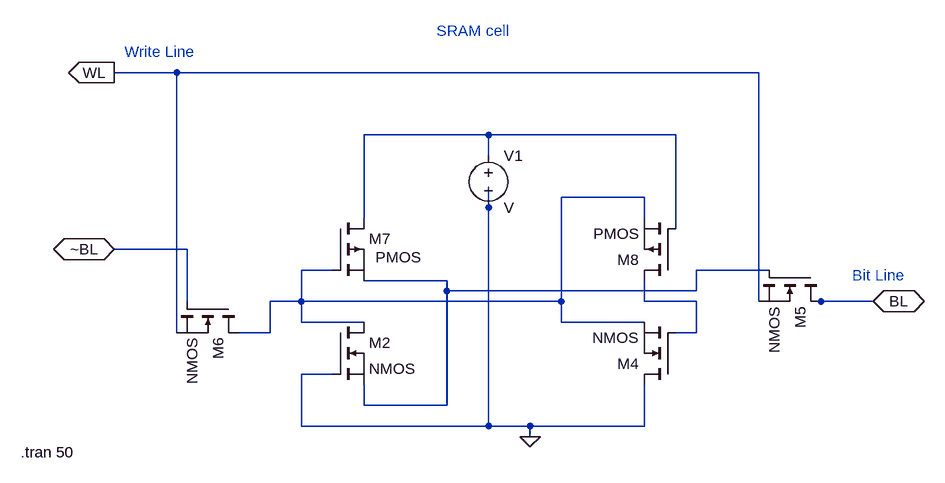
[diagram p0: schematic Circuit2_2_3.asc]
Circuit2_2_3.asc, the LTspice schematic file:
Version 4
SHEET 1 920 680
WIRE -240 -64 -336 -64
WIRE 656 -64 -240 -64
WIRE 240 32 48 32
WIRE 528 32 240 32
WIRE 240 64 240 32
WIRE 480 128 352 128
WIRE 240 144 240 112
WIRE 48 160 48 32
WIRE 480 160 480 128
WIRE 528 176 528 32
WIRE -224 208 -336 208
WIRE 0 240 -48 240
WIRE 672 240 560 240
WIRE 176 256 48 256
WIRE 176 272 176 256
WIRE 560 272 560 240
WIRE 560 272 176 272
WIRE -224 288 -224 208
WIRE -48 288 -48 240
WIRE -48 288 -96 288
WIRE 352 288 352 128
WIRE 352 288 -48 288
WIRE 480 288 480 256
WIRE 560 288 480 288
WIRE 656 288 656 -64
WIRE 752 288 736 288
WIRE 832 288 752 288
WIRE -48 320 -48 288
WIRE 48 320 -48 320
WIRE 352 320 352 288
WIRE 480 320 352 320
WIRE -240 336 -240 -64
WIRE -96 336 -96 288
WIRE -96 336 -144 336
WIRE 560 336 560 288
WIRE 560 336 528 336
WIRE 0 400 -48 400
WIRE 48 448 48 416
WIRE 176 448 176 272
WIRE 176 448 48 448
WIRE -48 480 -48 400
WIRE 240 480 240 144
WIRE 240 480 -48 480
WIRE 304 480 240 480
WIRE 480 480 480 416
WIRE 480 480 304 480
WIRE 304 496 304 480
FLAG 304 496 0
FLAG -336 -64 WL
IOPIN -336 -64 Out
FLAG 832 288 BL
IOPIN 832 288 BiDir
FLAG -336 208 ~BL
IOPIN -336 208 BiDir
SYMBOL nmos 0 320 R0
SYMATTR InstName M2
SYMBOL nmos 528 416 R180
SYMATTR InstName M4
SYMBOL voltage 240 48 R0
SYMATTR InstName V1
SYMBOL nmos 752 240 R90
SYMATTR InstName M5
SYMBOL nmos -144 288 R90
SYMATTR InstName M6
SYMBOL pmos 0 160 R0
WINDOW 3 66 60 Left 2
SYMATTR InstName M7
SYMBOL pmos 528 256 R180
SYMATTR InstName M8
TEXT -320 -96 Left 2 ;Write Line
TEXT 800 248 Left 2 ;Bit Line
TEXT 160 -128 Left 2 ;SRAM cell
TEXT -480 520 Left 2 !.tran 50

The netlist it stands for:
* Circuit2_2_3.asc
M2 N002 0 N003 N003 NMOS
M4 0 N004 N002 N002 NMOS
V1 N001 0 V
M5 BL N003 WL WL NMOS
M6 N002 ~BL WL WL NMOS
M7 N001 N002 N003 N003 PMOS
M8 N004 N001 N002 N002 PMOS
.model NMOS NMOS
.model PMOS PMOS
.lib standard.mos
* Write Line
* Bit Line
* SRAM cell
.tran 50
.backanno
.end